# Altium schematic sheet sensors.SchDoc
size A4
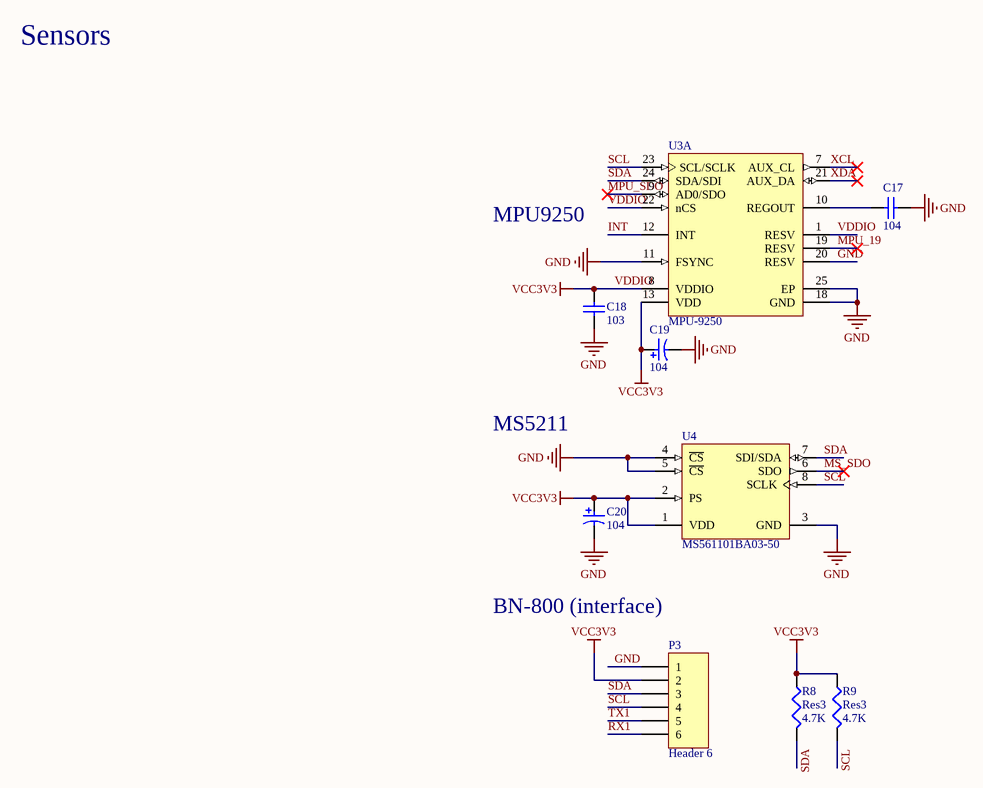
[diagram p0: sensors.SchDoc]

## Parts
C17  104  [C 0603]
C18  103  [C 0603]
C19  104  [AVX-1206-2-H1.8_L]
C20  104  [AVX-1206-2-H1.8_L]
P3  Header 6  [HDR1X6]
R8  Res3  value 4.7K  [J1-0603]
R9  Res3  value 4.7K  [J1-0603]
U3  MPU-9250  [INSE-QFN-24-1700X1540TP_M]  (part A of 2)
U4  MS561101BA03-50  [MSI-MS561101BA03-50-8_V]

## Nets
GND: C17.1 C18.1 C19.2 C20.2 P3.1 U3.11(FSYNC) U3.18(GND) U3.20(RESV) U3.25(EP) U4.3(GND) U4.4(~{CS}) U4.5(~{CS})
VDDIO: C18.2 C19.1 C20.1 P3.2 R8.1 R9.1 U3.1(RESV) U3.8(VDDIO) U3.13(VDD) U3.22(nCS) U4.1(VDD) U4.2(PS)  [also labelled VCC3V3]
INT: U3.12(INT)
MPU_19: U3.19(RESV)
MPU_SDO: U3.9(AD0/SDO)
MS_SDO: U4.6(SDO)
RX1: P3.6
SCL: P3.4 R9.2 U3.23(SCL/SCLK) U4.8(SCLK)
SDA: P3.3 R8.2 U3.24(SDA/SDI) U4.7(SDI/SDA)
TX1: P3.5
XCL: U3.7(AUX_CL)
XDA: U3.21(AUX_DA)
NetC17_2: C17.2 U3.10(REGOUT)

## Notes on the sheet
- Sensors
- MPU9250
- MS5211
- BN-800 (interface)

## Library data of the parts
C17 = Cap: Published: 8-Jun-2000; LatestRevisionDate: 17-Jul-2002; LatestRevisionNote: Re-released for DXP Platform.; Publisher: Altium Limited; Value: 104
C18 = Cap: Value: 104; Published: 8-Jun-2000; LatestRevisionDate: 17-Jul-2002; LatestRevisionNote: Re-released for DXP Platform.; Publisher: Altium Limited
C19 C20 = CMP-2000-07217-1: TAJ Series Standard Tantalum, 10 uF, +/- 10%, -55 to 125 degC, 2-Pin SMD (1206), RoHS, Tape and Reel; Manufacturer Size Code: A; Manufacturer: AVX; PCN Part Number: TAJSeriesSuffix08/Dec/2008; Voltage - Rated: 10V; Catalog Drawings: TAJSeriesSideTAJSeries; EDA / CAD Models: DownloadfromAcceleratedDesigns; Product Training Modules: ComponentSolutionsforSmartMeterApplications; ESR (Equivalent Series Resistance): 3Ohm; Type: Molded; Capacitance: 10µF; Other Names: 478-1654-6; Online Catalog: TAJSeries; Datasheet URL: https://datasheet.ciiva.com/26341/559409-da-01-en-tacc-a-3-2-mm-x-1-6-mm-x-1-6-mm-10-uf-26341749.pdf; Voltage Rating DC: 10V; Size / Dimension: 0.126"Lx0.063"W(3.20mmx1.60mm); Package / Case: 1206(3216Metric); Package Description: 2-Pin Chip Capacitor, Body 3.2 x 1.65 mm; Packaging: Digi-Reel®; Package Reference: 1206; Features: GeneralPurpose; Family: TantalumCapacitors; Height - Seated (Max): 0.071"(1.80mm); Category: Capacitors; Standard Package: 1; Tolerance: ±10%; Manufacturer URL: http://www.avx.com/; Mounting Technology: SurfaceMount; Operating Temperature: -55°C~125°C; Datasheet Version: 04/2013; Mounting Type: SurfaceMount; Lead Spacing: -; Series: TAJ; Lifetime @ Temp.: -
P3 = Header 6: Header, 6-Pin; LatestRevisionDate: 17-Jul-2002; LatestRevisionNote: Re-released for DXP Platform.; Publisher: Altium Limited
R8 R9 = Res3: Resistor; Published: 8-Jun-2000; LatestRevisionDate: 29-May-2009; LatestRevisionNote: IPC-7351 Footprint Added.; PackageReference: J1-0603; Publisher: Altium Limited; PackageDescription: Chip Resistor
U3 = CMP-2100-03657-1: 9-axis MotionTracking device, 2.4 to 3,6 V, -40 to 85 degC, 24-Pin QFN, RoHS, Tape and Reel; Manufacturer: InvenSense; Max Supply Voltage: 3.6V; Min Supply Voltage: 2.4V; Package Reference: QFN-24; Package Quantity: 1; Datasheet Version: Rev. 1.0, 01/2014; Case/Package: QFN; Package Description: 24-Pin Quad Flat No-lead Package, Body 3 x 3 mm, Pitch 0.4 mm; Datasheet URL: http://datasheet.octopart.com/MPU-9250-InvenSense-datasheet-21859386.pdf; RoHSCompliant: true; Max Operating Temperature: 85degC; Height: 1mm; Mount: SurfaceMount; Manufacturer URL: http://www.invensense.com/; Width: 3.1mm; Min Operating Temperature: -40degC; Length: 3.1mm
U4 = CMP-2000-05251-1: Barometric Pressure Sensor, with Stainless Steel Cap, 1.8 to 3.6 V, -45 to 85 degC, 8-Pin QFN, RoHS, Tape and Reel; Manufacturer: Measurement Specialties; Operating Pressure Max: 1200mbar; Supply Current: 12.5µA; Supply Voltage Max: 3.6V; Supply Voltage Min: 1.8V; No. of Pins: 8; Connection Size: 0.5mm; SVHC: NoSVHC(20-Jun-2013); Operating Pressure Min: 10mbar; Manufacturer URL: http://www.meas-spec.com/; Operating Temperature Min: -40degC; Pressure Type: Barometric; Package Reference: MS561101BA03-50-8; Datasheet URL: http://www.te.com/commerce/DocumentDelivery/DDEController?Action=srchrtrv&DocNm=MS5611-01BA03&DocType=Data+Sheet&DocLang=English&DocFormat=pdf&PartCntxt=CAT-BLPS0036; Package Description: 8-Pin Surface Mount Device, Body 5 x 3 mm, Pitch 1.25 mm; Sensor Case Style: QFN; Datasheet Version: Sep-15; Operating Temperature Max: 85degC